# EAGLE design piezo-buffer-and-preamp-ritter_V0-2-thru (EAGLE 7.5.0)
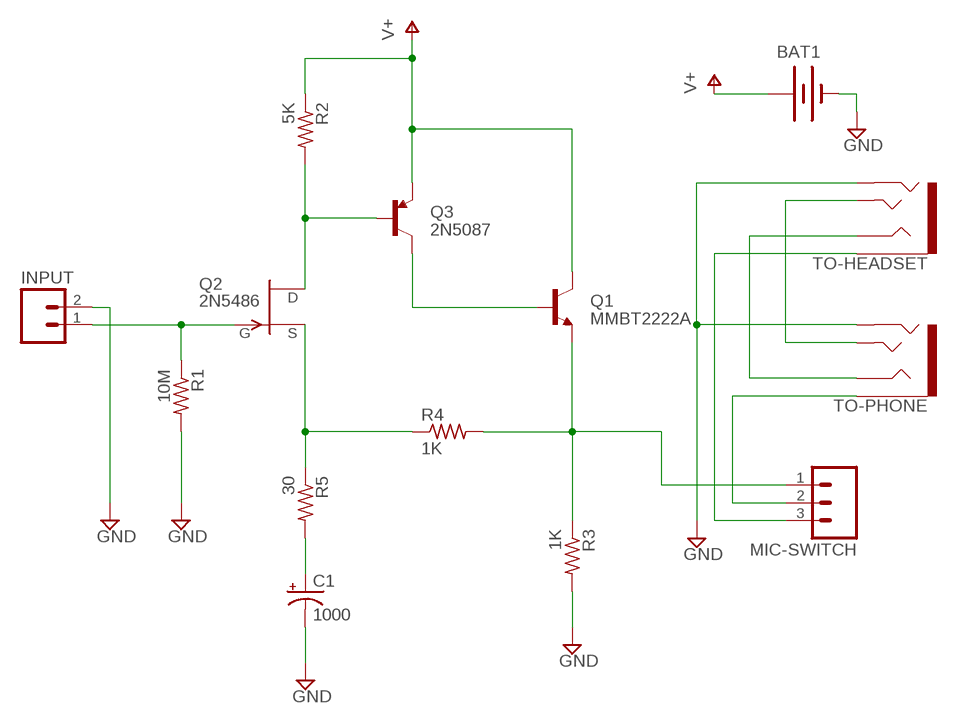
[diagram p0: schematic, sheet 1]

## Parts
BAT1  BATTERYAAA-KIT  [BATTERY-AAA-KIT]
C1  1000  CAP_POLPTH4  [CPOL-RADIAL-1000UF-25V]
INPUT  M02LOCK  [1X02_LOCK]
MIC-SWITCH  M03LOCK  [1X03_LOCK]
Q1  MMBT2222A  TRANSISTOR_NPNTO92  [TO-92]
Q2  2N5486  [TO92-]
Q3  2N5087  TRANSISTOR_PNPTO92  [TO-92]
R1  10M  R-US_V526-0  [V526-0]
R2  5K  R-US_V526-0  [V526-0]
R3  1K  R-US_V526-0  [V526-0]
R4  1K  R-US_V526-0  [V526-0]
R5  30  R-US_V526-0  [V526-0]
TO-HEADSET  AUDIO-JACK3  [AUDIO-JACK-TRRS-SMD]
TO-PHONE  AUDIO-JACK3  [AUDIO-JACK-TRRS-SMD]

## Nets
`DEL: MIC-SWITCH.1 Q1.1(E) R3.1 R4.2
GND: BAT1.GND@1(-) C1.- INPUT.2 R1.2 R3.2 TO-HEADSET.RING2 TO-PHONE.RING2
N$1: INPUT.1 Q2.1(G) R1.1
N$2: Q2.3(D) Q3.2(B) R2.2
N$4: Q2.2(S) R4.1 R5.1
N$5: Q1.2(B) Q3.3(C)
N$6: C1.+ R5.2
N$7: MIC-SWITCH.3 TO-HEADSET.EARTH
N$8: TO-HEADSET.TIP TO-PHONE.TIP
N$9: TO-HEADSET.RING1 TO-PHONE.RING1
TO-PHONE: MIC-SWITCH.2 TO-PHONE.EARTH
V+: BAT1.PWR@1(+) Q1.3(C) Q3.1(E) R2.1

## Library data of the parts
BAT1 = SparkFun-Electromechanical:BATTERY: Battery Holders Various common sizes : AA, AAA, 18650 (PRT-12895), 20mm coin cell and 12mm coin cell. 20MM_4LEGS, BATT-10373; PROD_ID: BATT-08571
C1 = SparkFun-Capacitors:CAP_POL: Capacitor Polarized These are standard SMD and PTH capacitors. Normally 10uF, 47uF, and 100uF in electrolytic and tantalum varieties. Always verify the external diameter of the through hole cap, it varies with capacity, voltage, and manufacturer. The EIA devices should be standard.
INPUT = CMU-ArtFab:M02: Header 2 Standard 2-pin 0.1" header. Use with straight break away headers (SKU : PRT-00116), right angle break away headers (PRT-00553), swiss pins (PRT-00743), machine pins (PRT-00117), and female headers (PRT-00115). Molex polarized connector foot print use with SKU : PRT-08233 with associated crimp pins and housings.
MIC-SWITCH = SparkFun-Connectors:M03: Header 3 Standard 3-pin 0.1" header. Use with straight break away headers (SKU : PRT-00116), right angle break away headers (PRT-00553), swiss pins (PRT-00743), machine pins (PRT-00117), and female headers (PRT-00115). Molex polarized connector foot print use with SKU : PRT-08232 with associated crimp pins and housings.
Q1 = CMU-ArtFab:TRANSISTOR_NPN: Generic NPN BJT MMBT2222A - TRANS-08049 (SOT-23, 1A 40V) MPSA42 - TRANS-09116 (SOT-23, 500mA 300V) MMBT5088LT1G - TRANS-11160 (SOT-23, 50 mA 30V) BC547 - COM-08928 <http://www.sparkfun.com/products/8928> (TO-92 45V 100mA) (1.Collector 2.Base 3.Emitter) 2N3904 - COM-00521 <http://www.sparkfun.com/products/521> (TO-92 40V 200mA) (1.Emitter 2.Base 3.Collector) P2N2222A - COM-12852 <http://www.sparkfun.com/products/12852> (TO-92 40V 600mA) (1.Collector 2.Base 3.Emitter)
Q2 = transistor-fet:?548*: N-Channel JFETs Source: VISHAY 2N5484.pdf Compatible: TO92 2N5245 J304 J305 U310 J308 J309 J310 TO72 2N4416 2N4416A 2N3823 2N4351 3N169 3N170 3N171 MFE3002 TO18 2N3796 2N3797 MFE825 Source: Motorola European Master Guide Pacge 3-59
Q3 = CMU-ArtFab:TRANSISTOR_PNP: Generic PNP BJT Double check pinouts against datasheets- not all devices are the same! MMBT3906 - 40V 200mA SOT-23 (TRANS-08052) MMBT4403 - 40V 600mA SOT-23 (TRANS-09245)
R1-R5 = resistor:R-US_: RESISTOR, American symbol
TO-HEADSET TO-PHONE = SparkFun-Connectors:AUDIO-JACK3: Audio jack - 3.5mm TRRS variety - two rings.

## Board
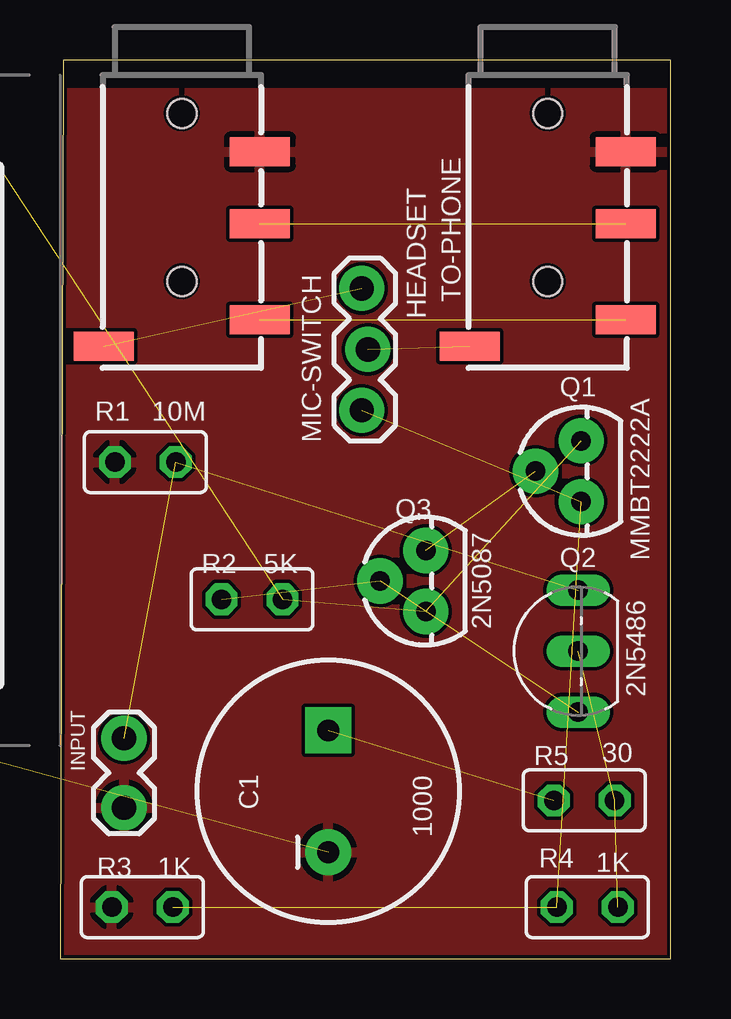
[diagram p1: board, top side]
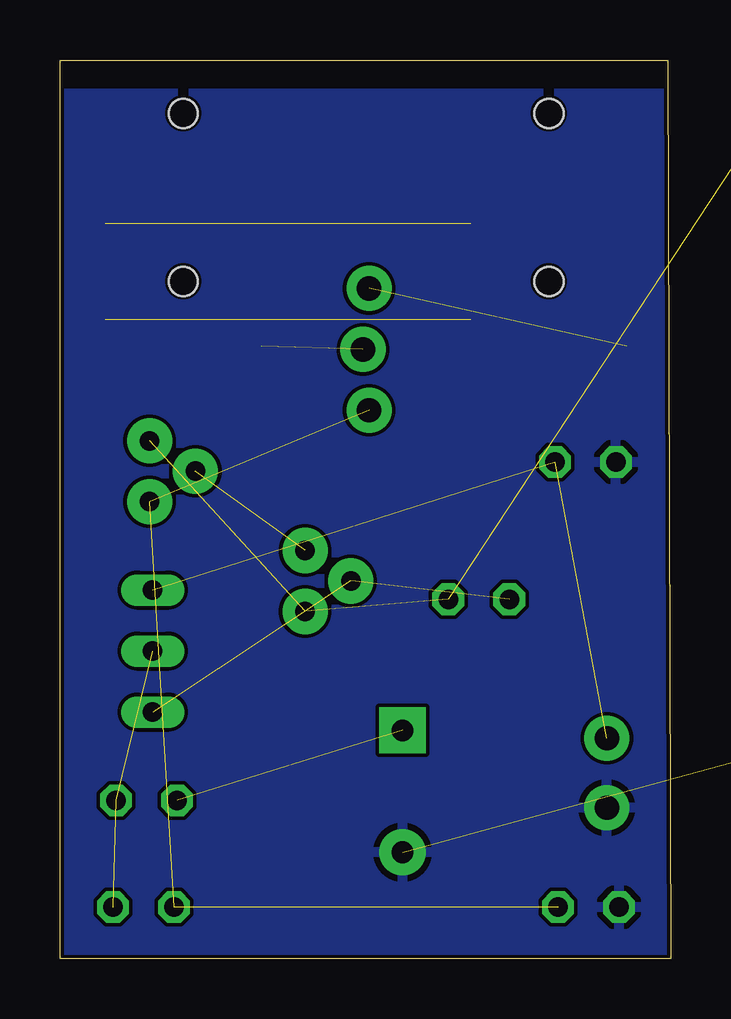
[diagram p2: board, bottom side, seen from below]

Size 25.45 x 37.46 mm. Coordinates in mm from the lower left corner, seen from the top.
Outline: 0,0 25.45,0 25.45,37.46 0.13,37.46 0,0
Copper layers (1*16): Top 0.035mm / dielectric 1.5mm / Bottom 0.035mm
Design rules "default *": minimum track width 6mil, minimum drill 6mil, track to track 6mil, track to pad 6mil, pad to pad 6mil, via to via 6mil, smd to smd 6mil, copper to edge 6mil, drill to drill 16mil, minimum pad ring 10mil, minimum via ring 8mil, stop-mask expansion 4mil, vias tented up to drill 0mil, thermal gap 10mil

### Footprints (pad centres in the part's own frame; a part is rotated, then mirrored left to right if it is on the bottom)
BATTERY-AAA-KIT = drill 1.702: GND@1 13.97,0; PWR@1 -13.97,0
CPOL-RADIAL-1000UF-25V = drill 0.9 pad 1.93 square: + 2.54,0 | drill 0.9 pad 1.93: - -2.54,0
1X02_LOCK = drill 1.016 pad 1.88: 1 -0.178,0; 2 2.718,0
1X03_LOCK = drill 1.016 pad 1.88: 1 0,0.127; 2 2.54,-0.127; 3 5.08,0.127
TO-92 = drill 0.813 pad 1.88: 1 -1.27,0; 2 0,1.905; 3 1.27,0
TO92- = drill 0.813 long: 1 2.54,0; 2 0,0; 3 -2.54,0
V526-0 = drill 0.813 octagon: 1 -1.27,0; 2 1.27,0
AUDIO-JACK-TRRS-SMD = smd 1.2 x 2.5: EARTH 11.3,-3.25; RING1 6.2,3.25; RING2 3.2,3.25; TIP 10.2,3.25 | hole 1.2: 1.6,0; 8.6,0

### Placement (x,y rotation side)
BAT1  -5.08,22.86 270 top  (outside the outline)
C1  11.18,6.98 90 top
INPUT  2.67,9.02 270 top
MIC-SWITCH  12.7,22.86 90 top
Q1  21.72,20.32 90 top
Q2  21.59,12.83 90 top
Q3  15.24,15.75 90 top
R1  3.56,20.7 180 top
R2  8,14.99 180 top
R3  3.43,2.16 180 top
R4  21.97,2.16 180 top
R5  21.84,6.6 180 top
TO-HEADSET  5.08,36.83 270 top
TO-PHONE  20.32,36.83 270 top

### Tracks (layer width: path | path; a pad name or v marks a point on that pad's centre or on a via)
`DEL  (3 unrouted)
GND  (1 unrouted)
  pour Top: 0,0 25.4,0 25.4,36.07 0,36.07
  pour Bottom: 0,0 25.4,0 25.4,36.07 0,36.07
N$1  (2 unrouted)
N$2  (2 unrouted)
N$4  (2 unrouted)
N$5  (1 unrouted)
N$6  (1 unrouted)
N$7  (1 unrouted)
N$8  (1 unrouted)
N$9  (1 unrouted)
TO-PHONE  (1 unrouted)
V+  (3 unrouted)